# EAGLE design cabin.clock (EAGLE 7.3.0)
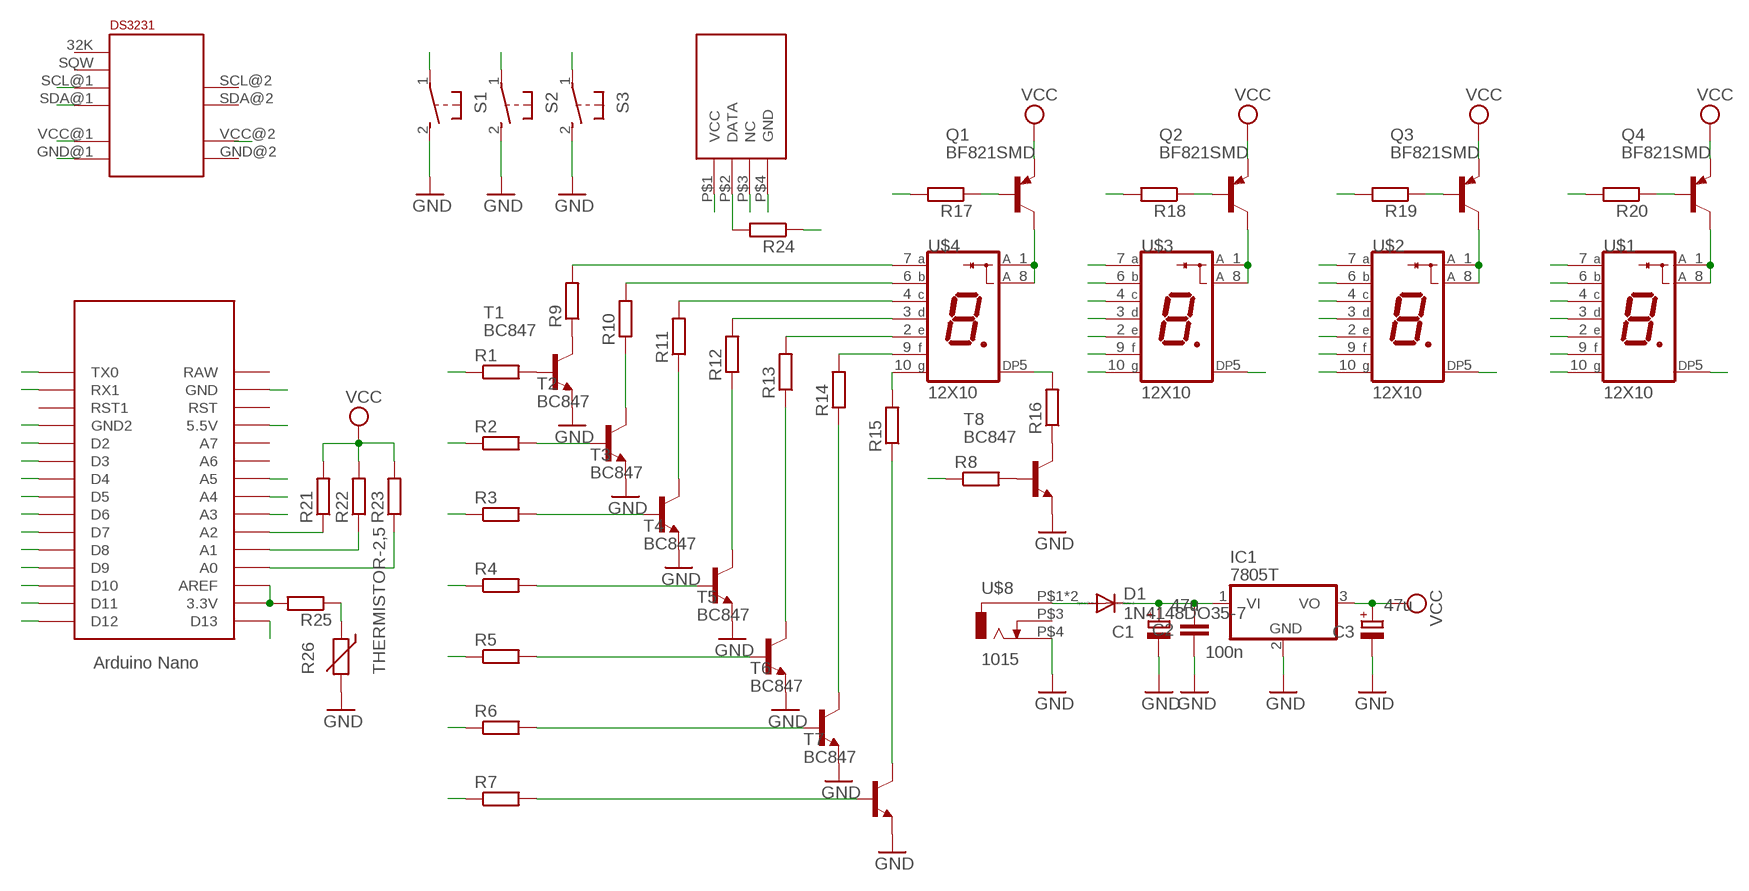
[diagram p0: schematic, sheet 1]

## Parts
C1  47u  CPOL-EUD  [PANASONIC_D]
C2  100n  C-EUC1206  [C1206]
C3  47u  CPOL-EUD  [PANASONIC_D]
D1  1N4148DO35-7  [DO35-7]
IC1  7805T  [TO220H]
Q1  BF821SMD  [SOT23-BEC]
Q2  BF821SMD  [SOT23-BEC]
Q3  BF821SMD  [SOT23-BEC]
Q4  BF821SMD  [SOT23-BEC]
R1  R-EU_0207/10  [0207/10]
R2  R-EU_0207/10  [0207/10]
R3  R-EU_0207/10  [0207/10]
R4  R-EU_0207/10  [0207/10]
R5  R-EU_0207/10  [0207/10]
R6  R-EU_0207/10  [0207/10]
R7  R-EU_0207/10  [0207/10]
R8  R-EU_0207/10  [0207/10]
R9  R-EU_0207/10  [0207/10]
R10  R-EU_0207/10  [0207/10]
R11  R-EU_0207/10  [0207/10]
R12  R-EU_0207/10  [0207/10]
R13  R-EU_0207/10  [0207/10]
R14  R-EU_0207/10  [0207/10]
R15  R-EU_0207/10  [0207/10]
R16  R-EU_0207/10  [0207/10]
R17  R-EU_0207/10  [0207/10]
R18  R-EU_0207/10  [0207/10]
R19  R-EU_0207/10  [0207/10]
R20  R-EU_0207/10  [0207/10]
R21  R-EU_0207/10  [0207/10]
R22  R-EU_0207/10  [0207/10]
R23  R-EU_0207/10  [0207/10]
R24  R-EU_0207/10  [0207/10]
R25  R-EU_0207/10  [0207/10]
R26  THERMISTOR-2,5  [RS-2,5]
S1  31-XX  [B3F-31XX]
S2  31-XX  [B3F-31XX]
S3  31-XX  [B3F-31XX]
T1  BC847  [SOT23]
T2  BC847  [SOT23]
T3  BC847  [SOT23]
T4  BC847  [SOT23]
T5  BC847  [SOT23]
T6  BC847  [SOT23]
T7  BC847  [SOT23]
T8  BC847  [SOT23]
U$1  12X10  [12X10]
U$2  12X10  [12X10]
U$3  12X10  [12X10]
U$4  12X10  [12X10]
U$5  NANO  [NANO]
U$6  DS3231BOARD  [BOARD]
U$7  DTH21  [DTH21]
U$8  1015  [1505]

## Nets
A: R9.2 U$1.7(A) U$2.7(A) U$3.7(A) U$4.7(A)
A0: R23.1 S1.1(P) U$5.A0
A1: R22.1 S2.1(P) U$5.A1
A2: R21.1 S3.1(P) U$5.A2
A3: R25.1 R26.1 U$5.A3
B: R10.2 U$1.6(B) U$2.6(B) U$3.6(B) U$4.6(B)
C: R11.2 U$1.4(C) U$2.4(C) U$3.4(C) U$4.4(C)
D: R12.2 U$1.3(D) U$2.3(D) U$3.3(D) U$4.3(D)
D2: R3.1 U$5.D2
D3: R4.1 U$5.D3
D4: R5.1 U$5.D4
D5: R6.1 U$5.D5
D6: R7.1 U$5.D6
D7: R8.1 U$5.D7
D8: R17.2 U$5.D8
D9: R18.2 U$5.D9
D10: R19.2 U$5.D10
D11: R20.2 U$5.D11
D12: U$5.D12
D13: R24.2 U$5.D13 U$7.P$2(DATA)
DP: R16.2 U$1.5(DP) U$2.5(DP) U$3.5(DP) U$4.5(DP)
E: R13.2 U$1.2(E) U$2.2(E) U$3.2(E) U$4.2(E)
F: R14.2 U$1.9(F) U$2.9(F) U$3.9(F) U$4.9(F)
G: R15.2 U$1.10(G) U$2.10(G) U$3.10(G) U$4.10(G)
GND: C1.- C2.2 C3.- IC1.2(GND) R26.2 S1.2(S) S2.2(S) S3.2(S) T1.2(E) T2.2(E) T3.2(E) T4.2(E) T5.2(E) T6.2(E) T7.2(E) T8.2(E) U$5.GND U$5.GND1(GND2) U$6.GND@1(GND) U$7.P$4(GND) U$8.P$4
N$1: R1.2 T1.1(B)
N$2: R8.2 T8.1(B)
N$3: Q4.C U$1.1(A) U$1.8(A)
N$4: R9.1 T1.3(C)
N$5: Q3.C U$2.1(A) U$2.8(A)
N$6: R16.1 T8.3(C)
N$7: Q2.C U$3.1(A) U$3.8(A)
N$8: Q1.C U$4.1(A) U$4.8(A)
N$9: Q1.B R17.1
N$10: Q2.B R18.1
N$11: Q3.B R19.1
N$12: Q4.B R20.1
N$13: D1.A U$8.P$1 U$8.P$2
N$14: R25.2 U$5.3.3V U$5.AREF
N$17: U$7.P$3(NC)
N$18: R10.1 T2.3(C)
N$19: R11.1 T3.3(C)
N$20: R12.1 T4.3(C)
N$21: R13.1 T5.3(C)
N$22: R14.1 T6.3(C)
N$23: R15.1 T7.3(C)
N$24: R2.2 T2.1(B)
N$25: R3.2 T3.1(B)
N$26: R4.2 T4.1(B)
N$27: R5.2 T5.1(B)
N$28: R6.2 T6.1(B)
N$29: R7.2 T7.1(B)
RX1: R1.1 U$5.RX1
SCL: U$5.A5 U$6.SCL@1(SCL)
SDA: U$5.A4 U$6.SDA@1(SDA)
TX0: R2.1 U$5.TX0
VCC: C3.+ IC1.3(VO) R21.2 R22.2 R23.2 R24.1 U$5.5V(5.5V) U$6.VCC@1(VCC) U$7.P$1(VCC)
VIN: C1.+ C2.1 D1.C IC1.1(VI) Q1.E Q2.E Q3.E Q4.E ; supply symbol labelled VCC
Unconnected: U$5.A6 U$5.A7 U$5.RAW U$5.RST U$5.RST1 U$6.32K U$6.SCL@2(SCL) U$6.SDA@2(SDA) U$6.SQW U$8.P$3

## Power pins joined to a net without a drawn wire
GND: U$6.GND@2(GND)
VIN: U$6.VCC@2(VCC)

## Library data of the parts
C1 C3 = rcl:CPOL-EU: POLARIZED CAPACITOR, European symbol
C2 = rcl:C-EU: CAPACITOR, European symbol
D1 = diode:1N4148: DIODE high speed (Philips)
IC1 = linear:78*: Positive VOLTAGE REGULATOR Source: http://cache.national.com/ds/LM/LM78L05.pdf http://www.fairchildsemi.com/ds/LM/LM7805.pdf
Q1-Q4 = transistor-pnp:BF821*: PNP Transistror
R1-R25 = rcl:R-EU_: RESISTOR, European symbol
R26 = varistor:THERMISTOR: THERMISTOR
S1-S3 = switch-omron:31-XX: OMRON SWITCH; MPN: B3F-3100; OC_FARNELL: 959704; OC_NEWARK: 36M3582
T1-T8 = transistor:BC847: NPN TRANSISTOR
U$1-U$4 = led-7-segment:12X10
U$5 = Arduino:NANO: Arduino Nano
U$6 = DS3232M:DS3231BOARD
U$7 = DTH21:DTH21
U$8 = con-jack:1015

## Net classes
0 default: width 0.406 mm, drill 0.406 mm, clearance 0.406 mm
1 power: width 0.61 mm, drill 0.406 mm, clearance 0.203 mm
3 power usb: width 0.508 mm, drill 0.406 mm, clearance 0.203 mm

## Board
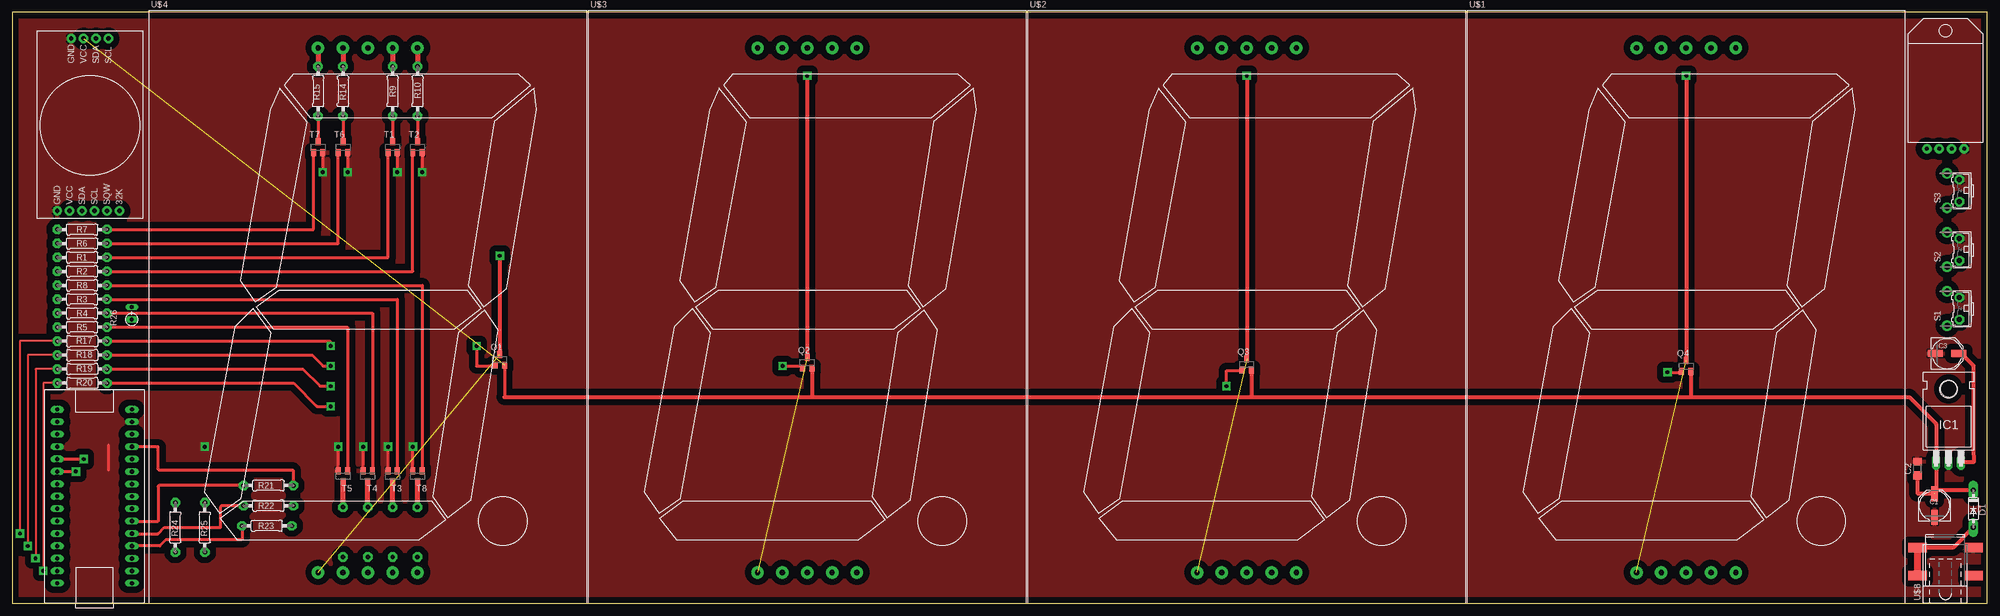
[diagram p1: board, top side]
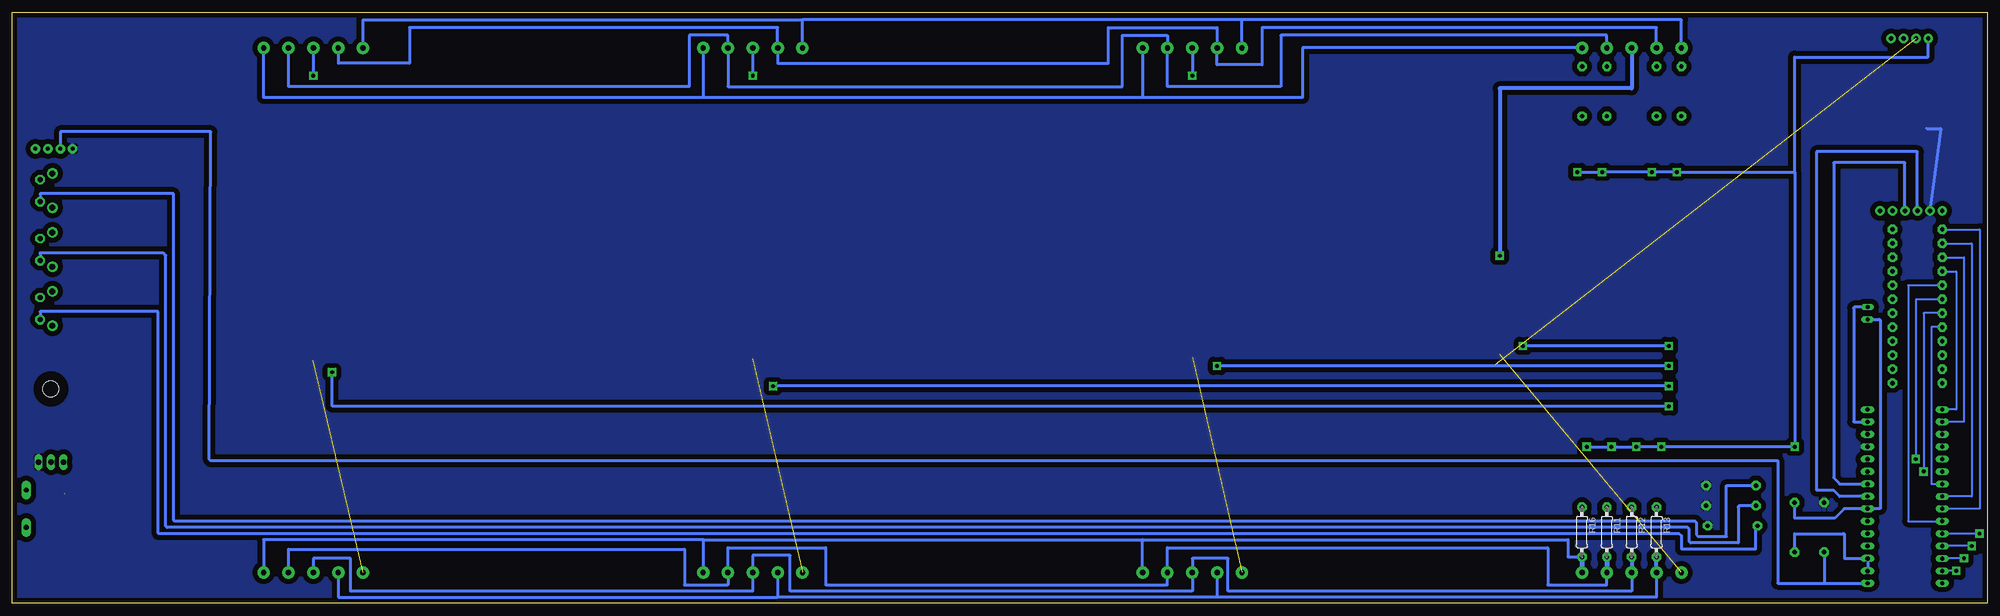
[diagram p2: board, bottom side, seen from below]

Size 403.84 x 120.96 mm. Coordinates in mm from the lower left corner, seen from the top.
Outline: 0,0 403.84,0 403.84,120.96 0,120.96 0,0
Copper layers (1*16): Top 0.035mm / dielectric 1.5mm / Bottom 0.035mm
Design rules "default": minimum track width 10mil, minimum drill 24mil, track to track 8mil, track to pad 8mil, pad to pad 8mil, via to via 8mil, smd to smd 8mil, copper to edge 40mil, drill to drill 8mil, minimum pad ring 10mil, minimum via ring 8mil, stop-mask expansion 4mil, vias tented up to drill 0mil, thermal gap 10mil

### Footprints (pad centres in the part's own frame; a part is rotated, then mirrored left to right if it is on the bottom)
PANASONIC_D = smd 3 x 1.4: + 2.4,0; - -2.4,0
C1206 = smd 1.6 x 1.8: 1 -1.4,0; 2 1.4,0
DO35-7 = drill 1 pad 1.93 long: A 3.81,0; C -3.81,0
TO220H = drill 1.118 long: 1 -2.54,-10.16; 2 0,-10.16; 3 2.54,-10.16 | hole 3.302: 0,4.826
SOT23-BEC = smd 1 x 1.4: B -0.95,-1.1; C 0,1.1; E 0.95,-1.1
0207/10 = drill 0.9 pad 1.93 octagon: 1 -5.08,0; 2 5.08,0
RS-2,5 = drill 0.813 long: 1 -1.27,0; 2 1.27,0
B3F-31XX = drill 1 pad 1.93 octagon: 1 -2.261,-1.245; 2 2.261,-1.245 | drill 1.2 pad 2.159: 3 -3.505,1.245; 4 3.505,1.245
SOT23 = smd 1 x 1.4: 1 -0.95,-1.1; 2 0.95,-1.1; 3 0,1.1
12X10 = drill 1.1 pad 2.54: 1 34.29,-114.935; 2 39.37,-114.935; 3 44.45,-114.935; 4 49.53,-114.935; 5 54.61,-114.935; 6 54.61,-7.62; 7 49.53,-7.62; 8 44.45,-7.62; 9 39.37,-7.62; 10 34.29,-7.62
NANO = drill 0.9 long: 3.3V -10.16,24.13; 5V -10.16,-1.27; A0 -10.16,19.05; A1 -10.16,16.51; A2 -10.16,13.97; A3 -10.16,11.43; A4 -10.16,8.89; A5 -10.16,6.35; A6 -10.16,3.81; A7 -10.16,1.27; AREF -10.16,21.59; D2 5.08,1.27; D3 5.08,3.81; D4 5.08,6.35; D5 5.08,8.89; D6 5.08,11.43; D7 5.08,13.97; D8 5.08,16.51; D9 5.08,19.05; D10 5.08,21.59; D11 5.08,24.13; D12 5.08,26.67; D13 -10.16,26.67; GND -10.16,-6.35; GND1 5.08,-1.27; RAW -10.16,-8.89; RST -10.16,-3.81; RST1 5.08,-3.81; RX1 5.08,-6.35; TX0 5.08,-8.89
BOARD = drill 0.9 pad 1.93: 32K 16.828,-36.83; GND@1 4.128,-36.83; GND@2 6.985,-1.587; SCL@1 11.748,-36.83; SCL@2 14.605,-1.587; SDA@1 9.207,-36.83; SDA@2 12.065,-1.587; SQW 14.287,-36.83; VCC@1 6.668,-36.83; VCC@2 9.525,-1.587
DTH21 = drill 0.8 pad 1.93: P$1 3.81,-1.27; P$2 6.35,-1.27; P$3 8.89,-1.27; P$4 11.43,-1.27
1505 = smd 1.93 x 3.81: P$1 5.715,10.16; P$2 11.43,10.16; P$3 5.715,-1.27; P$4 11.43,-1.27

### Placement (x,y rotation side)
C1  393.06,20 90 top
C2  389.57,27.62 90 top
C3  395.61,51.12 0 top
D1  401,19.37 270 top
IC1  395.92,39.05 0 top
Q1  99.69,49.85 0 top
Q2  162.56,49.21 0 top
Q3  252.41,48.9 0 top
Q4  342.27,48.58 0 top
R1  14.29,70.8 0 top
R2  14.29,67.94 0 top
R3  14.29,62.23 0 top
R4  14.29,59.37 0 top
R5  14.29,56.52 0 top
R6  14.29,73.66 0 top
R7  14.29,76.52 0 top
R8  14.29,65.09 0 top
R9  77.79,104.78 90 top
R10  82.87,104.78 90 top
R11  77.79,14.61 270 bottom
R12  72.71,14.61 270 bottom
R13  67.63,14.61 270 bottom
R14  67.63,104.78 90 top
R15  62.55,104.78 90 top
R16  82.87,14.61 270 bottom
R17  14.29,53.66 180 top
R18  14.29,50.8 180 top
R19  14.29,47.94 180 top
R20  14.29,45.09 180 top
R21  52.39,24.13 0 top
R22  52.39,20 0 top
R23  52.07,15.88 0 top
R24  33.34,15.56 270 top
R25  39.37,15.56 270 top
R26  24.45,59.37 90 top
S1  396.88,60.32 90 top
S2  396.88,72.39 90 top
S3  396.88,84.46 90 top
T1  77.79,93.34 0 top
T2  82.87,93.34 0 top
T3  77.79,26.04 180 top
T4  72.71,26.04 180 top
T5  67.63,26.04 180 top
T6  67.63,93.34 0 top
T7  62.55,93.34 0 top
T8  82.87,26.04 180 top
U$1  297.81,121.28 0 top
U$2  207.96,121.28 0 top
U$3  118.11,121.28 0 top
U$4  28.26,121.28 0 top
U$5  14.29,30.8 180 top
U$6  5.08,117.16 0 top
U$7  387.67,94.3 0 top
U$8  399.73,0 90 top

### Tracks (layer width: path | path; a pad name or v marks a point on that pad's centre or on a via)
A
  Top 1.016: U$4.7 R9.2
  Bottom 0.61: U$1.7 347.35,105.73 265.43,105.73 265.43,116.21 257.49,116.21 U$2.7 257.49,105.73 176.85,105.73 176.85,116.21 167.64,116.21 U$3.7 167.64,105.73 144.46,105.73 144.46,116.21 77.79,116.21 U$4.7
A0
  Top 0.61: R23.1 46.99,13.02 31.43,13.02 30.16,11.75 U$5.A0
  Bottom 0.61: R23.1 47.31,15.88 arc-90 47.41,15.77 47.41,11.11 62.55,11.11 62.55,13.86 62.97,14.29 373.76,14.29 arc90 374.02,14.54 374.02,59.69 398.15,59.69 398.12,59.66 S1.1
A1
  Top 0.61: R22.1 42.8,20 42.55,19.75 42.55,15.56 31.12,15.56 29.84,14.29 U$5.A1
  Bottom 0.61: R22.1 50.65,20 arc-90 50.91,19.75 50.91,12.38 60.64,12.38 60.96,12.7 60.96,15.24 61.28,15.56 372.17,15.56 372.43,15.81 372.43,71.18 373,71.75 398.15,71.75 398.12,71.41 S2.1
A2
  Top 0.61: U$5.A2 29.84,16.83 29.84,23.88 arc-90 30.1,24.13 R21.1
  Bottom 0.61: R21.1 53.34,24.13 53.34,13.65 59.05,13.65 59.48,14.07 59.48,16.51 59.8,16.83 370.59,16.83 370.84,17.08 370.84,83.82 398.15,83.82 398.12,83.79 S3.1
A3
  Bottom 0.61: R26.1 22.16,58.1 arc90 21.91,57.85 21.91,19.37 U$5.A3 29.27,19.37 31.18,17.46 39.37,17.46 R25.1
B
  Top 1.016: U$4.6 R10.2
  Bottom 0.61: U$3.6 172.72,103.5 | 172.72,103.5 262.57,103.5 | 262.57,103.5 352.42,103.5 U$1.6 | U$2.6 262.57,103.5 | U$4.6 140.02,113.66 140.02,103.5 172.72,103.5
C
  Bottom 0.61: U$1.4 347.35,11.11 266.38,11.11 266.38,3.81 257.49,3.81 U$2.4 257.49,11.43 237.49,11.43 237.49,3.81 167.64,3.81 U$3.4 167.64,11.43 89.85,11.43 89.85,3.81 77.79,3.81 U$4.4
  Bottom 1.016: R11.2 U$4.4
D
  Bottom 0.61: U$4.3 72.71,2.54 155.26,2.54 155.26,9.21 162.56,9.21 U$3.3 162.56,2.54 244.79,2.54 244.79,9.84 252.41,9.84 U$2.3 252.41,2.54 334.65,2.54 334.65,9.21 342.27,9.21 U$1.3
  Bottom 0.813: R12.2 U$4.3
D2  (via drill 0.8 pad 1.68)
  Top 0.61: U$5.D2 v14.61,29.53
  Bottom 0.406: R3.1 14.61,62.23 v14.61,29.53
D3  (via drill 0.8 pad 1.68)
  Top 0.61: U$5.D3 v13.02,26.99
  Bottom 0.406: R4.1 13.02,59.37 v13.02,26.99
D4
  Bottom 0.406: R5.1 11.43,56.52 11.43,24.45 U$5.D4
D5
  Bottom 0.406: R6.1 3.17,73.66 3.17,21.91 U$5.D5
D6
  Bottom 0.406: R7.1 1.59,76.52 1.59,19.37 U$5.D6
D7
  Bottom 0.406: R8.1 16.19,65.09 16.19,16.83 U$5.D7
D8  (via drill 0.8 pad 1.68)
  Top 0.406: R17.2 1.59,53.66 v1.59,14.29
  Bottom 0.406: v1.59,14.29 U$5.D8
D9  (via drill 0.8 pad 1.68)
  Top 0.406: R18.2 3.17,50.8 v3.17,11.75
  Bottom 0.406: v3.17,11.75 U$5.D9
D10  (via drill 0.8 pad 1.68)
  Top 0.406: R19.2 4.76,47.94 v4.76,9.21
  Bottom 0.406: v4.76,9.21 U$5.D10
D11  (via drill 0.8 pad 1.68)
  Top 0.406: R20.2 6.35,45.09 v6.35,6.67
  Bottom 0.406: v6.35,6.67 U$5.D11
D13
  Bottom 0.61: U$7.P$2 394.02,96.52 363.22,96.52 363.54,29.46 363.28,29.21 42.86,29.21 42.86,4.13 33.34,4.13 | 33.34,4.13 U$5.D13 | R24.2 33.34,4.13
DP
  Bottom 0.61: U$3.5 172.72,13.02 | 172.72,13.02 85.73,13.02 85.73,9.53 R16.2 | 262.57,13.02 172.72,13.02 | 262.57,13.02 U$2.5 | 262.57,13.02 352.42,13.02 U$1.5
  Bottom 1.016: R16.2 U$4.5
E
  Bottom 0.61: U$4.2 67.63,1.27 157.48,1.27 | 157.48,1.27 247.33,1.27 | U$2.2 247.33,1.27 | U$3.2 157.48,1.27 | U$1.2 337.18,1.27 247.33,1.27
  Bottom 0.813: U$4.2 R13.2
F
  Top 1.016: U$4.9 R14.2
  Bottom 0.61: U$4.9 67.63,117.79 148.27,117.79 148.27,110.17 157.48,110.17 U$3.9 157.48,117.79 179.7,117.79 179.7,110.49 247.33,110.49 U$2.9 247.33,117.79 322.58,117.79 322.58,110.49 337.18,110.49 U$1.9
G
  Top 1.016: U$4.10 R15.2
  Bottom 0.61: U$4.10 62.55,119.38 152.4,119.38 | 152.4,119.38 242.25,119.38 | U$2.10 242.25,119.38 | U$1.10 332.1,119.38 242.25,119.38 | U$3.10 152.4,119.38
GND  (via drill 0.8 pad 1.68)
  Top 0.61: T7.2 v63.5,88.26 | T6.2 v68.58,88.26 | T1.2 v78.74,88.26 | T2.2 v83.82,88.26 | T5.2 v66.68,32.07 | T4.2 v71.76,32.07 | T3.2 v76.83,32.07 | T8.2 v81.91,32.07 | 19.68,27.3 19.68,32.38 | 39.37,32.38 v39.37,32.07
  Bottom 0.61: v83.82,88.26 v78.74,88.26 v68.58,88.26 v63.5,88.26 39.37,88.26 | v81.91,32.07 v76.83,32.07 v71.76,32.07 v66.68,32.07 v39.37,32.07 39.37,88.26 | 39.37,88.26 39.37,111.76 12.06,111.76 U$6.GND@2 | R26.2 27.05,60.64 arc-90 27.31,60.39 27.31,37.15 U$5.GND
  pour Top (isolate 1.27): 0.32,124.46 407.1,124.46 arc-90 407.35,124.21 407.35,-4.45 0.57,-4.45 arc-90 0.32,-4.19
N$1
  Top 0.61: R1.2 76.84,70.8 T1.1
N$2
  Top 0.61: R8.2 83.82,65.09 T8.1
N$3  (via drill 0.8 pad 1.68)  (1 unrouted)
  Top 0.813: v342.27,107.95 Q4.C
  Bottom 0.61: U$1.8 v342.27,107.95
N$4
  Top 0.61: R9.1 T1.3
N$5  (via drill 0.8 pad 1.68)  (1 unrouted)
  Top 0.813: v252.41,107.95 Q3.C
  Bottom 0.61: U$2.8 v252.41,107.95
N$6
  Top 1.016: R16.1 T8.3
N$7  (via drill 0.8 pad 1.68)  (1 unrouted)
  Top 0.813: v162.56,107.95 Q2.C
  Bottom 0.61: U$3.8 v162.56,107.95
N$8  (via drill 0.8 pad 1.68)  (1 unrouted)
  Top 0.813: v99.69,71.12 Q1.C
  Bottom 0.813: U$4.8 72.71,105.41 99.69,105.41 v99.69,71.12
N$9  (via drill 0.8 pad 1.68)
  Top 0.61: v94.93,52.7 94.93,48.58 98.57,48.58 arc90 Q1.B | R17.1 64.83,53.66 arc-90 65.09,53.4 v65.09,52.7
  Bottom 0.61: v65.09,52.7 v94.93,52.7
N$10  (via drill 0.8 pad 1.68)
  Top 0.61: v157.48,48.58 161.61,48.58 Q2.B | R18.1 61.34,50.8 63.56,48.58 v65.09,48.58
  Bottom 0.61: v65.09,48.58 v157.48,48.58
N$11  (via drill 0.8 pad 1.68)
  Top 0.61: v248.29,44.45 248.29,47.62 251.14,47.62 Q3.B | R19.1 59.44,47.94 62.93,44.45 v65.09,44.45
  Bottom 0.61: v65.09,44.45 v248.29,44.45
N$12  (via drill 0.8 pad 1.68)
  Top 0.61: v338.46,47.31 341.15,47.31 arc90 Q4.B | R20.1 57.53,45.09 62.29,40.32 v65.09,40.32
  Bottom 0.61: v65.09,40.32 338.2,40.32 arc90 338.46,40.58 v338.46,47.31
N$13
  Top 0.813: D1.A 396.87,11.43 U$8.P$2
  Top 1.422: U$8.P$2 U$8.P$1
N$14
  Bottom 0.61: U$5.3.3V U$5.AREF 29.21,9.21 29.21,14.03 arc-90 29.46,14.29 39.37,14.29 R25.2
N$18
  Top 0.61: R10.1 T2.3
N$19
  Top 1.016: R11.1 T3.3
N$20
  Top 1.016: R12.1 T4.3
N$21
  Top 1.016: R13.1 T5.3
N$22
  Top 0.61: R14.1 T6.3
N$23
  Top 0.61: R15.1 T7.3
N$24
  Top 0.61: R2.2 81.92,67.94 T2.1
N$25
  Top 0.61: R3.2 78.74,62.23 T3.1
N$26
  Top 0.61: R4.2 73.66,59.37 T4.1
N$27
  Top 0.61: R5.2 68.58,56.52 T5.1
N$28
  Top 0.61: R6.2 66.68,73.66 T6.1
N$29
  Top 0.61: R7.2 61.6,76.52 T7.1
RX1
  Bottom 0.406: R1.1 4.76,70.8 4.76,37.15 U$5.RX1
SCL
  Bottom 0.61: U$6.SCL@1 16.83,90.17 31.43,90.17 31.43,25.72 30.16,24.45 U$5.A5
SDA
  Bottom 0.61: U$6.SDA@1 14.29,92.39 34.92,92.39 34.92,23.18 31.43,23.18 30.16,21.91 U$5.A4
TX0
  Bottom 0.406: R2.1 6.35,67.94 6.35,39.69 U$5.TX0
VCC
  Top 0.61: R21.2 57.47,27.05 arc90 57.21,27.3 30.1,27.3 arc-90 29.84,27.56 29.84,32.07 U$5.5V
  Top 0.813: IC1.3 400.9,28.89 arc45 401.08,28.97 401,31.75 401,48.65 398.53,51.12 C3.+
  Bottom 0.61: 12.38,97.16 9.52,97.16 U$6.VCC@1
  Bottom 0.813: IC1.3 398.46,28.26
  pour Bottom (isolate 1.016): 0.32,121.28 405.19,121.28 arc-90 407.35,124.84 404.81,-0.32 0.57,-0.32 arc-90 0.32,-4.19
VIN  (2 unrouted)
  Top 0.61: Q1.E 100.65,48.43 100.65,42.23
  Top 0.813: 100.65,42.23 163.51,42.23 | 163.51,42.23 253.36,42.23 | 253.36,42.23 343.22,42.23 | 343.22,42.23 387.88,42.23 393.38,36.73 IC1.1 393.38,23.18 | Q2.E 163.51,42.23 | Q3.E 253.36,42.23 | Q4.E 343.22,42.23 | 393.38,23.18 393.38,23.05 393.06,22.73 C1.+ | C2.1 389.57,22.54 393.06,22.54 | D1.C 393.38,23.18